# Altium schematic sheet topsheet_Power.SchDoc
size 762 x 508 mm
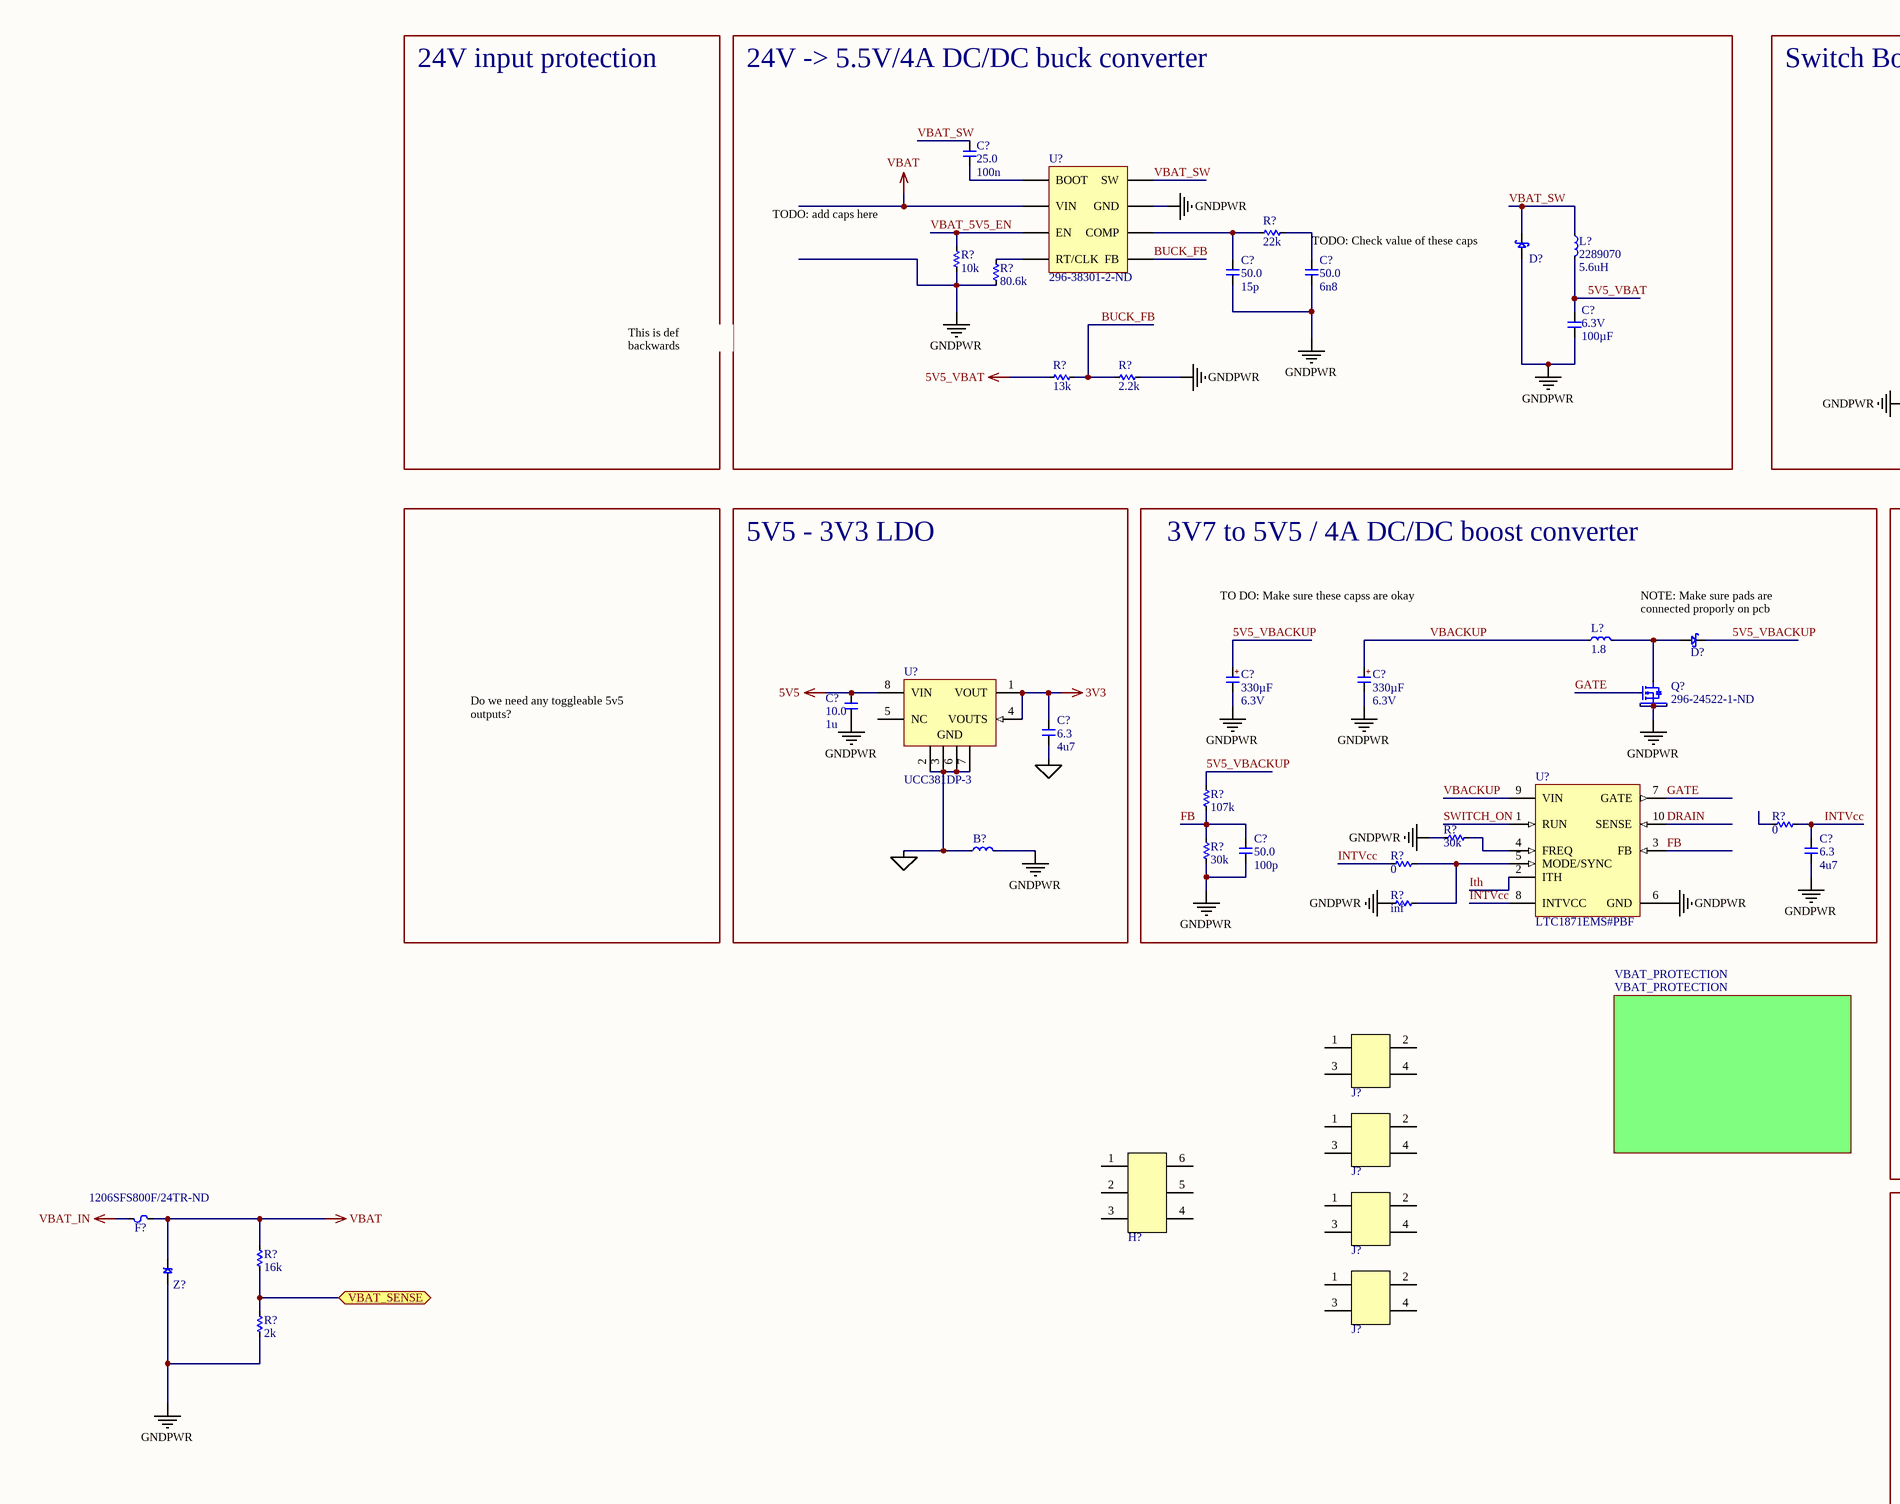
[diagram p0: topsheet_Power.SchDoc, left]
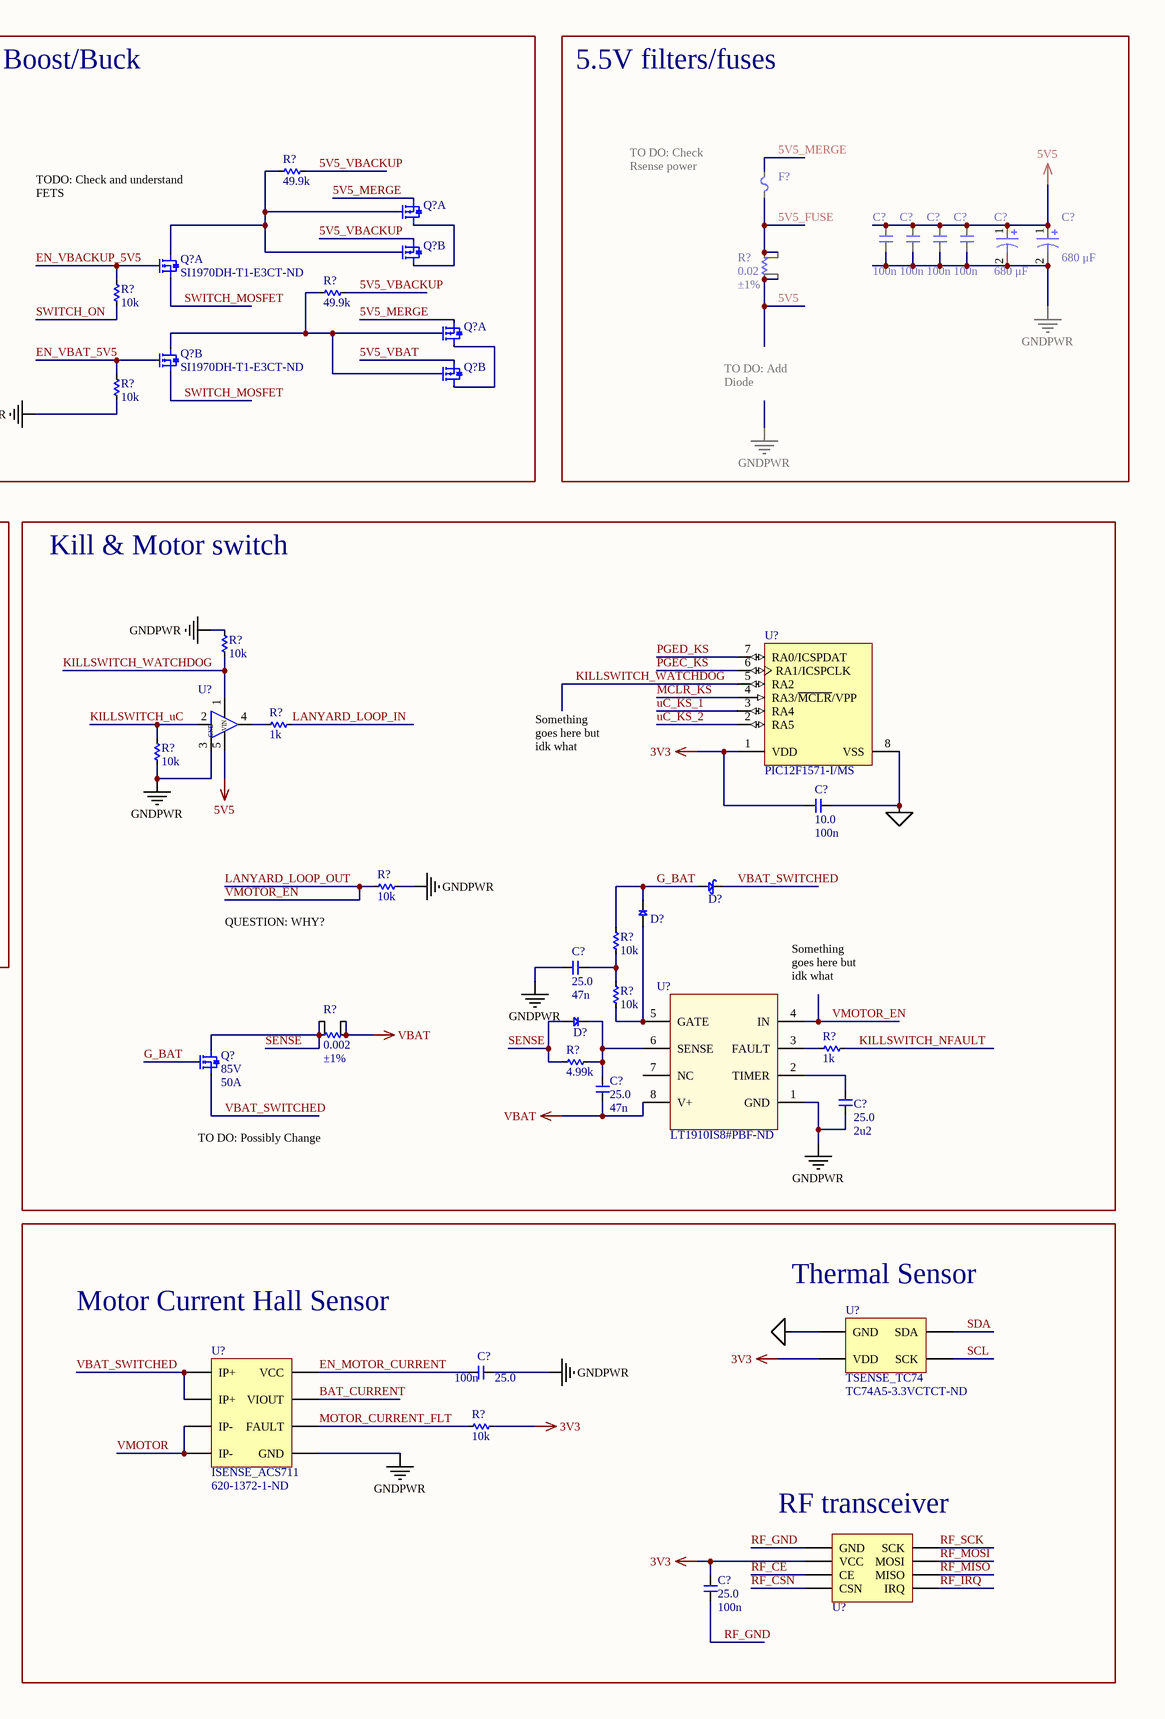
[diagram p1: topsheet_Power.SchDoc, right]

## Parts
(Parts that share a designator on the sheet are numbered #1, #2 ... from top to bottom, then left to right.)
B?  FB_782853112  [R0805]  (value not drawn)
C?#1  voltage: 25.0  human_value: 100n  [C0603]  (hidden comment: __template_cap)
C?#2  human_value: 100n  [C0603]  (hidden comment: __template_cap)
C?#3  human_value: 100n  [C0603]  (hidden comment: __template_cap)
C?#4  human_value: 100n  [C0603]  (hidden comment: __template_cap)
C?#5  human_value: 100n  [C0603]  (hidden comment: __template_cap)
C?#6  680 μF  [WCAP-PTG5 8x8x3.5x0.6]
C?#7  680 μF  [WCAP-PTG5 8x8x3.5x0.6]
C?#8  voltage: 50.0  human_value: 15p  [C0603]  (hidden comment: __template_cap)
C?#9  voltage: 50.0  human_value: 6n8  [C0603]  (hidden comment: __template_cap)
C?#10  Capacitance: 100µF  Voltage - Rated: 6.3V  [C1206]  (hidden comment: __template_cap)
C?#11  Capacitance: 330µF  Voltage - Rated: 6.3V  [C1210P]  (hidden comment: CAP_TANT_330UF_6.3V)
C?#12  Capacitance: 330µF  Voltage - Rated: 6.3V  [C1210P]  (hidden comment: CAP_TANT_330UF_6.3V)
C?#13  voltage: 10.0  human_value: 1u  [C0603]  (hidden comment: __template_cap)
C?#14  voltage: 6.3  human_value: 4u7  [C0603]  (hidden comment: __template_cap)
C?#15  voltage: 10.0  human_value: 100n  [C0603]  (hidden comment: __template_cap)
C?#16  voltage: 50.0  human_value: 100p  [C0603]  (hidden comment: __template_cap)
C?#17  voltage: 6.3  human_value: 4u7  [C0603]  (hidden comment: __template_cap)
C?#18  voltage: 25.0  human_value: 47n  [C0603]  (hidden comment: __template_cap)
C?#19  voltage: 25.0  human_value: 47n  [C0603]  (hidden comment: __template_cap)
C?#20  voltage: 25.0  human_value: 2u2  [C1210]  (hidden comment: __template_cap)
C?#21  voltage: 25.0  human_value: 100n  [C0603]  (hidden comment: __template_cap)
C?#22  voltage: 25.0  human_value: 100n  [C0603]  (hidden comment: __template_cap)
D?#1  __template_diode_schottky  [SMC]  (value not drawn)
D?#2  __template_diode_schottky  [PowerDI5]  (value not drawn)
D?#3  __template_diode_schottky  [DO-220AA]  (value not drawn)
D?#4  __template_diode_std  [SOD523]  (value not drawn)
D?#5  __template_diode_std  [SOD523]  (value not drawn)
F?#1  __template_fuse  (value not drawn)
F?#2  Supplier Part Number 1: 1206SFS800F/24TR-ND  [R1206]  (hidden comment: __template_fuse)
H?  CONN_MOLEX_MICROFIT_43045-0624  [MOLEX_MICROFIT_0430450624]  (value not drawn)
J?#1  CONN HEADER 2x2POS T/H  [CONN_2x2_100MIL_FEMALE_SAMTEC]  (value not drawn)
J?#2  CONN HEADER 2x2POS T/H  [CONN_2x2_100MIL_FEMALE_SAMTEC]  (value not drawn)
J?#3  CONN HEADER 2x2POS T/H  [CONN_2x2_100MIL_FEMALE_SAMTEC]  (value not drawn)
J?#4  CONN HEADER 2x2POS T/H  [CONN_2x2_100MIL_FEMALE_SAMTEC]  (value not drawn)
L?#1  Supplier Part Number 1: 2289070  Inuductance: 5.6uH  [COILCRAFT_XAL5050-103]  (hidden comment: IND_COILCRAFT_XAL5050-562)
L?#2  Inductance: 1.8  [IND_COILCRAFT_XAL60]  (hidden comment: IND_COILCRAFT_XAL6030-182)
Q?#1  PFET_IRF7329PBFCT-ND  [8SOIC150]  (value not drawn)  (part A of 2)
Q?#2  PFET_IRF7329PBFCT-ND  [8SOIC150]  (value not drawn)  (part B of 2)
Q?#3  Supplier Part Number 1: SI1970DH-T1-E3CT-ND  [SOT363-6N]  (hidden comment: NFET_SI1970DH)  (part A of 2)
Q?#4  PFET_IRF7329PBFCT-ND  [8SOIC150]  (value not drawn)  (part A of 2)
Q?#5  Supplier Part Number 1: SI1970DH-T1-E3CT-ND  [SOT363-6N]  (hidden comment: NFET_SI1970DH)  (part B of 2)
Q?#6  PFET_IRF7329PBFCT-ND  [8SOIC150]  (value not drawn)  (part B of 2)
Q?#7  Supplier Part Number 1: 296-24522-1-ND  [8-VSON]  (hidden comment: NFET_CSD16323Q3)
Q?#8  Drain to Source Voltage (Vdss): 85V  Current - Continuous Drain (Id) @ 25° C: 50A  [DPAK]  (hidden comment: 85V 50A TO-252)
R?#1  value 49.9k  [R0603]  (hidden comment: __template_resistor)
R?#2  value 22k  [R0603]  (hidden comment: __template_resistor)
R?#3  value 10k  [R0603]  (hidden comment: __template_resistor)
R?#4  Resistance (Ohms): 0.02  Tolerance: ±1%  [R0805_SHUNT]  (hidden comment: RESISTOR .020 OHM 1/4W 1% 0805)  (net tie)
R?#5  value 80.6k  [R0603]  (hidden comment: __template_resistor)
R?#6  value 49.9k  [R0603]  (hidden comment: __template_resistor)
R?#7  value 10k  [R0603]  (hidden comment: __template_resistor)
R?#8  value 13k  [R0603]  (hidden comment: __template_resistor)
R?#9  value 2.2k  [R0603]  (hidden comment: __template_resistor)
R?#10  value 10k  [R0603]  (hidden comment: __template_resistor)
R?#11  value 10k  [R0603]  (hidden comment: __template_resistor)
R?#12  value 1k  [R0603]  (hidden comment: __template_resistor)
R?#13  value 10k  [R0603]  (hidden comment: __template_resistor)
R?#14  value 107k  [R0603]  (hidden comment: __template_resistor)
R?#15  Resistance: 0  [R0603]  (hidden comment: __template_resistor)
R?#16  value 30k  [R0603]  (hidden comment: __template_resistor)
R?#17  value 30k  [R0603]  (hidden comment: __template_resistor)
R?#18  Resistance: 0  [R0603]  (hidden comment: __template_resistor)
R?#19  value 10k  [R0603]  (hidden comment: __template_resistor)
R?#20  Resistance: inf  [R0603]  (hidden comment: __template_resistor)
R?#21  value 10k  [R0603]  (hidden comment: __template_resistor)
R?#22  value 10k  [R0603]  (hidden comment: __template_resistor)
R?#23  Resistance (Ohms): 0.002  Tolerance: ±1%  [R1206_SHUNT]  (hidden comment: RES_CURRENT_SENSE_0.002_OHM_1W_1%_1206_SMD)  (net tie)
R?#24  value 1k  [R0603]  (hidden comment: __template_resistor)
R?#25  value 4.99k  [R0603]  (hidden comment: __template_resistor)
R?#26  value 16k  [R0603]  (hidden comment: __template_resistor)
R?#27  value 2k  [R0603]  (hidden comment: __template_resistor)
R?#28  value 10k  [R0402]  (hidden comment: __template_resistor)
U?#1  Supplier Part Number 1: 296-38301-2-ND  [8SOIC150E]  (hidden comment: BUCK_TPS54540)
U?#2  PIC12F1571-I/MS  [MCHP-MSOP-MS8_N]
U?#3  UCC381DP-3  [TI-D8_N]
U?#4  BUFFER_SN74AHCT1G125DBVR  [5SOT23]  (value not drawn)
U?#5  LTC1871EMS#PBF  [LT-MS-10_N]
U?#6  Supplier Part Number 1: LT1910IS8#PBF-ND  [8SOIC150]  (hidden comment: FETDRIVER_LT1910)
U?#7  TSENSE_TC74  Supplier Part Number 1: TC74A5-3.3VCTCT-ND  [5SOT23]
U?#8  ISENSE_ACS711  Supplier Part Number 1: 620-1372-1-ND  [8SOIC150]
U?#9  SEEEDSTUDIO_nRF24L01+  [SEEEDSTUDIO_nRF24L01]  (value not drawn)
Z?  __template_diode_zener  [DO-214AA]  (value not drawn)

## Blocks framed on the sheet
24V -> 5.5V/4A DC/DC buck converter: C?#1 C?#8-C?#10 D?#1 L?#1 R?#2 R?#3 R?#5 R?#8 R?#9 U?#1
Switch Boost/Buck: Q?#1-Q?#6 R?#1 R?#6 R?#7 R?#10
5.5V filters/fuses: C?#2-C?#7 F?#1 R?#4
5V5 - 3V3 LDO: B? C?#13 C?#14 U?#3
3V7 to 5V5 / 4A DC/DC boost converter: C?#11 C?#12 C?#16 C?#17 D?#2 L?#2 Q?#7 R?#14-R?#18 R?#20 U?#5
Kill & Motor switch: C?#15 C?#18-C?#20 D?#3-D?#5 Q?#8 R?#11-R?#13 R?#19 R?#21-R?#25 U?#2 U?#4 U?#6

## Sub-sheets
VBAT_PROTECTION = VBAT_PROTECTION: no entries

## Ports
VBAT_SENSE

## Nets
3V3: C?#14.1 C?#15.1 C?#22.1 R?#28.2 U?#2.1(VDD) U?#3.1(VOUT) U?#3.4(VOUTS) U?#7.3(VDD) U?#9.2(VCC)
5V5: C?#2.1 C?#3.1 C?#4.1 C?#5.1 C?#6.1 C?#7.1 C?#13.1 R?#4.1 R?#4.3 U?#3.8(VIN) U?#4.5(VIN)
5V5_VBAT: C?#10.1 L?#1.2 Q?#6.3 R?#8.1
GDNSIG: B?.1 C?#14.2 C?#15.2 U?#2.8(VSS) U?#3.2(GND) U?#3.3(GND) U?#3.6(GND) U?#3.7(GND) U?#7.2(GND)
GNDPWR: B?.2 C?#2.2 C?#3.2 C?#4.2 C?#5.2 C?#6.2 C?#7.2 C?#8.2 C?#9.2 C?#10.2 C?#11.2 C?#12.2 C?#13.2 C?#16.2 C?#17.2 C?#18.2 C?#20.2 C?#21.2 D?#1.1 Q?#7.1(S) Q?#7.2(S) Q?#7.3(S) R?#3.1 R?#5.1 R?#9.2 R?#10.1 R?#11.2 R?#13.1 R?#16.1 R?#17.1 R?#19.1 R?#20.1 R?#27.1 U?#1.7(GND) U?#4.3(GND) U?#5.6(GND) U?#6.1(GND) U?#8.5(GND) Z?.1
VBAT: C?#19.2 F?#2.2 R?#23.1 R?#23.3 R?#26.2 U?#1.2(VIN) U?#6.8(V+) Z?.2
VBAT_IN: F?#2.1
5V5_FUSE: F?#1.2 R?#4.2 R?#4.4
5V5_MERGE: F?#1.1 Q?#1.1 Q?#4.1
5V5_VBACKUP: C?#11.1 D?#2.2 Q?#2.3 R?#1.2 R?#6.2 R?#14.2
BAT_CURRENT: U?#8.7(VIOUT)
BUCK_FB: R?#8.2 R?#9.1 U?#1.5(FB)
DRAIN: U?#5.10(SENSE)
EN_MOTOR_CURRENT: C?#21.1 U?#8.8(VCC)
EN_VBACKUP_5V5: Q?#3.2 R?#7.2
EN_VBAT_5V5: Q?#5.5 R?#10.2
FB: C?#16.1 R?#14.1 R?#17.2 U?#5.3(FB)
G_BAT: D?#3.1 D?#4.2 Q?#8.1 R?#21.2
GATE: Q?#7.4(G) U?#5.7(GATE)
INTVcc: C?#17.1 R?#15.2 R?#18.1 U?#5.8(INTVCC)
Ith: U?#5.2(ITH)
KILLSWITCH_NFAULT: R?#24.2
KILLSWITCH_uC: R?#13.2 U?#4.2
KILLSWITCH_WATCHDOG: R?#11.1 U?#2.5(RA2) U?#4.1
LANYARD_LOOP_IN: R?#12.2
LANYARD_LOOP_OUT: R?#19.2 U?#6.4(IN)  [also labelled VMOTOR_EN]
MCLR_KS: U?#2.4(RA3/~{MCLR}/VPP)
MOTOR_CURRENT_FLT: R?#28.1 U?#8.6(FAULT)
PGEC_KS: U?#2.6(RA1/ICSPCLK)
PGED_KS: U?#2.7(RA0/ICSPDAT)
RF_CE: U?#9.3(CE)
RF_CSN: U?#9.4(CSN)
RF_GND: C?#22.2 U?#9.1(GND)
RF_IRQ: U?#9.8(IRQ)
RF_MISO: U?#9.7(MISO)
RF_MOSI: U?#9.6(MOSI)
RF_SCK: U?#9.5(SCK)
SCL: U?#7.4(SCK)
SDA: U?#7.5(SDA)
SENSE: D?#5.1 Q?#8.2 R?#23.2 R?#23.4 R?#25.1
SWITCH_MOSFET: Q?#3.1 Q?#5.4
SWITCH_ON: R?#7.1 U?#5.1(RUN)
uC_KS_1: U?#2.3(RA4)
uC_KS_2: U?#2.2(RA5)
VBACKUP: C?#12.1 L?#2.1 U?#5.9(VIN)
VBAT_5V5_EN: R?#3.2 U?#1.3(EN)
VBAT_SENSE: R?#26.1 R?#27.2 ; port VBAT_SENSE
VBAT_SW: C?#1.1 D?#1.2 L?#1.1 U?#1.8(SW)
VBAT_SWITCHED: D?#3.2 Q?#8.3 U?#8.1(IP+) U?#8.2(IP+)
VMOTOR: U?#8.3(IP-) U?#8.4(IP-)
NetC?#1_2: C?#1.2 U?#1.1(BOOT)
NetC?#8_1: C?#8.1 R?#2.1 U?#1.6(COMP)
NetC?#9_1: C?#9.1 R?#2.2
NetC?#18_1: C?#18.1 R?#21.1 R?#22.2
NetC?#19_1: C?#19.1 D?#5.2 R?#25.2 U?#6.6(SENSE)
NetC?#20_1: C?#20.1 U?#6.2(TIMER)
NetD?#2_1: D?#2.1 L?#2.2 Q?#7.5(D)
NetD?#4_1: D?#4.1 R?#22.1 U?#6.5(GATE)
NetQ?#1_2: Q?#1.2 Q?#2.4 Q?#3.6 R?#1.1
NetQ?#1_8: Q?#1.8 Q?#2.6
NetQ?#4_2: Q?#4.2 Q?#5.3 Q?#6.4 R?#6.1
NetQ?#4_8: Q?#4.8 Q?#6.6
NetR?#5_2: R?#5.2 U?#1.4(RT/CLK)
NetR?#12_1: R?#12.1 U?#4.4
NetR?#16_2: R?#16.2 U?#5.4(FREQ)
NetR?#18_2: R?#18.2 R?#20.2 U?#5.5(MODE/SYNC)
NetR?#24_1: R?#24.1 U?#6.3(FAULT)

Not connected (* = marked no-connect by the designer): H? 1 2 3 4 5 6; J?#1 1 2 3 4; J?#2 1 2 3 4; J?#3 1 2 3 4; J?#4 1 2 3 4; R?#15 1; U?#3 5(NC); U?#6 7(NC)

## Notes on the sheet
- 24V input protection
- (near F?#1) TO DO: Check Rsense power
- TODO: add caps here
- TODO: Check value of these caps
- TODO: Check and understand FETS
- This is def backwards
- TO DO: Add Diode
- TO DO: Make sure these capss are okay
- NOTE: Make sure pads are connected proporly on pcb
- Do we need any toggleable 5v5 outputs?
- Something goes here but idk what
- (near R?#19) QUESTION: WHY?
- (near U?#6) Something goes here but idk what
- TO DO: Possibly Change Mosfet
- Motor Current Hall Sensor
- (near U?#7) Thermal Sensor
- (near U?#9) RF transceiver
- (in symbol CAP_TANT_330UF_6.3V) +

## Library data of the parts
B? = FB_782853112: FERRITE BEAD 1100 OHM 800MA; Manufacturer: Wurth Electronics Inc; Supplier 1: Digi-Key; RoHS: RoHS Compliant; Category: Filters; Stock 1: 4000; Pricing 1: 1=0.21, 50=0.19, 100=0.175, 500=0.165, 1000=0.159, 2000=0.15 (USD); ComponentLink1URL: http://katalog.we-online.de/pbs/datasheet/782853112.pdf; ComponentLink1Description: http://katalog.we-online.de/pbs/datasheet/782853112.pdf; Supplier Part Number 1: 732-6713-1-ND; Manufacturer Part Number: 782853112
C?#1 = 399-1281-1-ND: type: capacitor; value: 1e-07; tolerance: 10%; Supplier Part Number 1: 399-1281-1-ND; package: 0603; price: 0.075
C?#2-C?#5 = 399-1095-1-ND: voltage: 10.0; type: capacitor; value: 1e-07; tolerance: 10%; Supplier Part Number 1: 399-1095-1-ND; package: 0603; price: 0.053
C?#6 C?#7 = WCAP-PTG5 8x8x3.5x0.6 870025174008: WCAP-PTG5 Aluminum Polymer Capacitors , 680 μF; + / - 20%; 6,3 V , 8 x 8; Manufacturer: Wurth Elektronik; E-mail: libraries@we-online.com; Characteristics: Aluminum Polymer Capacitors; Recommended soldering: Wave ;Operating temperature: –55 °C to +105 °C ; Low ESR at high frequency range; High permissible ripple current; Long life: 2000 h @ +105 °C; ComponentLink1Description: Manufacturer; ComponentLink1URL: http://www.we-online.com; ComponentLink2Description: Datasheet; ComponentLink2URL: http://katalog.we-online.de/pbs/datasheet/870025174008.pdf; Created by: Karrer Zheng; Created Date: 5/13/2015; Capacitance: 680 μF; Application: Low voltage port filtering, appplid to high-end switching power supply, PC(desktop,laptop ),industrial computer, VGA card, server power, charger, TV, digital set-top box,DC-DC power module, game machine etc which consume large current with high speed circuit.; partNo: 870025174008
C?#8 = 478-1165-1-ND: type: capacitor; value: 1.5e-11; tolerance: 5%; Supplier Part Number 1: 478-1165-1-ND; package: 0603; price: 0.16
C?#9 = 399-1090-1-ND: type: capacitor; value: 6.8e-09; tolerance: 5%; Supplier Part Number 1: 399-1090-1-ND; package: 0603; price: 0.429
C?#10 = __template_cap: Manufacturer: Murata Electronics North America; Manufacturer Part Number: GRM31CR60J107ME39K; Tolerance: ±20%; Temperature Coefficient: X5R; Supplier 1: Digi-Key; Supplier Part Number 1: 490-7217-1-ND; RoHS: RoHS Compliant; Category: Capacitors; Stock 1: 49063; Pricing 1: 1=0.6, 10=0.57, 50=0.34, 100=0.2763, 250=0.22952, 500=0.20826, 1000=0.19125 (USD); Packaging: Cut Tape (CT); Mounting Type: Surface Mount, MLCC; Operating Temperature: -55°C ~ 85°C; Applications: General Purpose; Ratings: -; Package / Case: 1206 (3216 Metric); Size / Dimension: 0.126" L x 0.063" W (3.20mm x 1.60mm); Height - Seated (Max): -; Thickness (Max): 0.071" (1.80mm); Lead Spacing: -; Features: -; Lead Style: -; ComponentLink1URL: http://www.murata.com/~/media/webrenewal/support/library/catalog/products/capacitor/mlcc/c02e.pdf; ComponentLink1Description: http://www.murata.com/~/media/webrenewal/support/library/catalog/products/capacitor/mlcc/c02e.pdf
C?#11 C?#12 = CAP_TANT_330UF_6.3V: 330UF 1210 SMD TANTALUM CAPACITOR; Manufacturer: AVX Corporation; Manufacturer Part Number: F950J337KBAAQ2; Manufacturer Size Code: B; Tolerance: ±10%; ESR (Equivalent Series Resistance): 600 mOhm; Type: Conformal Coated; Supplier 1: Digi-Key; RoHS: RoHS Compliant; Category: Capacitors; Stock 1: 12610; Pricing 1: 1=2.24, 10=1.857, 100=1.5567, 250=1.28356, 500=1.14702, 1000=1.03778 (USD); Packaging: Cut Tape (CT); Operating Temperature: -55°C ~ 125°C; Mounting Type: Surface Mount; Package / Case: 1210 (3528 Metric); Size / Dimension: 0.138" L x 0.110" W (3.50mm x 2.80mm); Height - Seated (Max): 0.079" (2.00mm); Lead Spacing: -; Features: General Purpose; Lifetime @ Temp.: -; ComponentLink1URL: http://datasheets.avx.com/f95.pdf; ComponentLink1Description: http://datasheets.avx.com/f95.pdf; Supplier Part Number 1: 478-8407-1-ND
C?#13 = 478-1251-1-ND: type: capacitor; value: 1e-06; tolerance: 10%; Supplier Part Number 1: 478-1251-1-ND; package: 0603; price: 0.138
C?#14 = 399-3482-1-ND: type: capacitor; value: 4.7e-06; tolerance: 10%; Supplier Part Number 1: 399-3482-1-ND; package: 0603; price: 0.18
C?#15 = 399-1095-1-ND: type: capacitor; value: 1e-07; tolerance: 10%; Supplier Part Number 1: 399-1095-1-ND; package: 0603; price: 0.053
C?#16 = 478-1175-1-ND: type: capacitor; value: 1e-10; tolerance: 5%; Supplier Part Number 1: 478-1175-1-ND; package: 0603; price: 0.05
C?#17 = 587-1255-1-ND: type: capacitor; value: 4.7e-06; tolerance: 20%; Supplier Part Number 1: 587-1255-1-ND; package: 0603; price: 0.18
C?#18 C?#19 = 478-1235-1-ND: type: capacitor; value: 4.7e-08; tolerance: 10%; Supplier Part Number 1: 478-1235-1-ND; package: 0603; price: 0.12
C?#20 = 399-3084-1-ND: type: capacitor; value: 2.2e-06; tolerance: 10%; Supplier Part Number 1: 399-3084-1-ND; package: 1210; price: 0.536
C?#21 C?#22 = 399-1282-1-ND: type: capacitor; value: 1e-07; tolerance: 5%; Supplier Part Number 1: 399-1282-1-ND; package: 0603; price: 0.349
D?#1 = __template_diode_schottky: Manufacturer: Vishay Semiconductor Diodes Division; Manufacturer Part Number: SSC54-E3/57T; Voltage - DC Reverse (Vr) (Max): 40V; Current - Average Rectified (Io): 5A; Voltage - Forward (Vf) (Max) @ If: 490mV @ 5A; Speed: Fast Recovery =< 500ns, > 200mA (Io); Current - Reverse Leakage @ Vr: 500µA @ 40V; Supplier 1: Digi-Key; Supplier Part Number 1: SSC54-E3/57TGICT-ND; RoHS: RoHS Compliant; Category: Discrete Semiconductor Products; Stock 1: 16997; Pricing 1: 1=0.59, 10=0.52, 25=0.4884, 100=0.3984, 250=0.37012 (USD); Packaging: Cut Tape (CT); Diode Type: Schottky; Reverse Recovery Time (trr): -; Capacitance @ Vr, F: -; Mounting Type: Surface Mount; Package / Case: DO-214AB, SMC; Supplier Device Package: DO-214AB, (SMC); Operating Temperature - Junction: -65°C ~ 150°C; ComponentLink1URL: http://www.vishay.com/docs/88885/ssc53l.pdf; ComponentLink1Description: http://www.vishay.com/docs/88885/ssc53l.pdf
D?#3 = __template_diode_schottky: Manufacturer: Vishay Semiconductor Diodes Division; Manufacturer Part Number: SMP12A-M3/84A; Type: Zener; Unidirectional Channels: 1; Voltage - Reverse Standoff (Typ): 12V; Voltage - Breakdown (Min): 13.3V; Voltage - Clamping (Max) @ Ipp: 19.9V; Current - Peak Pulse (10/1000µs): 20.1A; Power - Peak Pulse: 400W; Power Line Protection: No; Supplier 1: Digi-Key; Supplier Part Number 1: SMP12A-M3/84ACT-ND; RoHS: RoHS Compliant; Category: Circuit Protection; Stock 1: 5653; Pricing 1: 1=0.42, 10=0.314, 25=0.2832, 100=0.1957, 250=0.1648, 500=0.1339, 1000=0.103 (USD); Packaging: Cut Tape (CT); Bidirectional Channels: -; Applications: General Purpose; Capacitance @ Frequency: -; Operating Temperature: -55°C ~ 150°C (TJ); Mounting Type: Surface Mount; Package / Case: DO-220AA; Supplier Device Package: DO-220AA (SMP); ComponentLink1URL: http://www.vishay.com/docs/88481/smp3v3.pdf; ComponentLink1Description: http://www.vishay.com/docs/88481/smp3v3.pdf
D?#4 D?#5 = __template_diode_std: Manufacturer: Panasonic Electronic Components; Manufacturer Part Number: DA2S10100L; Diode Type: Standard; Voltage - DC Reverse (Vr) (Max): 80V; Current - Average Rectified (Io): 100mA (DC); Voltage - Forward (Vf) (Max) @ If: 1.2V @ 100mA; Speed: Small Signal =< 200mA (Io), Any Speed; Reverse Recovery Time (trr): 3ns; Current - Reverse Leakage @ Vr: 100nA @ 75V; Capacitance @ Vr, F: 1.2pF @ 0V, 1MHz; Supplier 1: Digi-Key; Supplier Part Number 1: DA2S10100LCT-ND; RoHS: RoHS Compliant; Category: Discrete Semiconductor Products; Stock 1: 95803; Pricing 1: 1=0.1, 10=0.04, 25=0.0324, 100=0.0252, 250=0.02448, 500=0.02378, 1000=0.02162 (USD); Packaging: Cut Tape (CT); Mounting Type: Surface Mount; Package / Case: SC-79, SOD-523; Supplier Device Package: SSMini2-F5-B; Operating Temperature - Junction: 150°C (Max); ComponentLink1URL: http://industrial.panasonic.com/www-cgi/jvcr13pz.cgi?E+SC+4+ANA7001+DA2S101+8+WW; ComponentLink1Description: http://industrial.panasonic.com/www-cgi/jvcr13pz.cgi?E+SC+4+ANA7001+DA2S101+8+WW
F?#2 = __template_fuse: Manufacturer: Littelfuse Inc.; Manufacturer Part Number: 1206SFS800F/24-2; Fuse Type: Board Mount (Cartridge Style Excluded); Current Rating: 8A; Voltage Rating - DC: 24V; Response Time: Slow; Breaking Capacity @ Rated Voltage: 60A; Melting I²t: 16.9; Approvals: UL; DC Cold Resistance: 0.009 Ohm; Supplier 1: Digi-Key; RoHS: RoHS Compliant; Category: Circuit Protection; Stock 1: 6000; Pricing 1: 3000=0.31625, 6000=0.3105, 15000=0.299 (USD); Packaging: Tape & Reel (TR); Voltage Rating - AC: -; Package / Case: 1206 (3216 Metric); Mounting Type: Surface Mount; Operating Temperature: -55°C ~ 125°C; Color: -; Size / Dimension: 0.126" L x 0.063" W x 0.038" H (3.20mm x 1.60mm x 0.97mm); ComponentLink1URL: http://www.te.com/commerce/DocumentDelivery/DDEController?Action=srchrtrv&DocNm=CLP00009&DocType=CS&DocLang=English; ComponentLink1Description: http://www.te.com/commerce/DocumentDelivery/DDEController?Action=srchrtrv&DocNm=CLP00009&DocType=CS&DocLang=English
H? = CONN_MOLEX_MICROFIT_43045-0624: MOLEX MICROFIT 2 ROW 6PIN VERT ThroughHole; Manufacturer: Molex Inc; Manufacturer Part Number: 0430450624; Connector Type: Header, Shrouded; Number of Positions: 6; Number of Positions Loaded: All; Pitch: 0.118" (3.00mm); Supplier 1: Digi-Key; RoHS: RoHS Compliant; Category: Connectors, Interconnects; Stock 1: 1294; Pricing 1: 1=1.75, 10=1.45, 50=1.2082, 100=1.074, 250=0.93976, 500=0.8592, 1000=0.77865, 2500=0.6981, 5000=0.68468 (USD); Contact Type: Male Pin; Number of Rows: 2; Row Spacing: 0.118" (3.00mm); Contact Mating Length: -; Mounting Type: Through Hole; Termination: Kinked Pin; Fastening Type: Latch Lock; Features: Board Lock; Contact Finish: Tin; Contact Finish Thickness: 100µin (2.54µm); Color: Black; Packaging: Tray; ComponentLink1URL: http://www.molex.com/elqNow/elqRedir.htm?ref=http://www.molex.com/pdm_docs/sd/430450624_sd.pdf; ComponentLink1Description: http://www.molex.com/elqNow/elqRedir.htm?ref=http://www.molex.com/pdm_docs/sd/430450624_sd.pdf; Supplier Part Number 1: WM4039-ND
J?#1-J?#4 = CONN_2x2
L?#1 = IND_COILCRAFT_XAL5050-562: INDUCTOR 5.6UH 20% SMD; Manufacturer Part Number: XAL5050-562MEB; Supplier 1: Farnell; Manufacturer: COILCRAFT; RoHS: YES; Stock 1: 158; Pricing 1: 1=3.16, 2=2.73, 3=2.52, 5=2.31, 10=1.88 (GBP); ComponentLink1URL: http://www.farnell.com/datasheets/1681990.pdf; ComponentLink1Description: http://www.farnell.com/datasheets/1681990.pdf
L?#2 = IND_COILCRAFT_XAL6030-182: Fixed Inductors XAL6030 High Current 1.8 uH 20 % 14 A; Manufacturer Part Number: XAL6030-182MEC; Product Range: AEC-Q200 XAL6030 Series; Inductance Tolerance: ± 20%; Inductor Construction: Shielded; DC Resistance Max: 0.01052; RMS Current (Irms): 14; Saturation Current (Isat): 18.2; Power Inductor Case: 6.56mm x 6.36mm x 3.1; SVHC: No SVHC (15-Jun-2015); Self Resonant Frequency Min: 34; Supplier 1: Farnell; Manufacturer: COILCRAFT; RoHS: YES; Pricing 1: 1=2.08, 15=1.4, 40=1.34, 90=1.16, 200=0.949 (GBP); Packaging: Cut Tape; ComponentLink1URL: http://www.farnell.com/datasheets/1681993.pdf; ComponentLink1Description: http://www.farnell.com/datasheets/1681993.pdf; Supplier Part Number 1: 2289082
Q?#1 Q?#2 Q?#4 Q?#6 = PFET_IRF7329PBFCT-ND: MOSFET 2P-CH 12V 9.2A 8-SOIC; Manufacturer: Infineon Technologies; Manufacturer Part Number: IRF7329TRPBF; FET Type: 2 P-Channel (Dual); FET Feature: Logic Level Gate; Rds On (Max) @ Id, Vgs: 17 mOhm @ 9.2A, 4.5V; Vgs(th) (Max) @ Id: 900mV @ 250µA; Gate Charge (Qg) @ Vgs: 57nC @ 4.5V; Input Capacitance (Ciss) @ Vds: 3450pF @ 10V; Power - Max: 2W; Supplier 1: Digi-Key; RoHS: RoHS Compliant; Category: Discrete Semiconductor Products; Stock 1: 8920; Pricing 1: 1=1.18, 10=1.054, 100=0.822, 500=0.67908, 1000=0.53612 (USD); Packaging: Cut Tape (CT); Drain to Source Voltage (Vdss): 12V; Current - Continuous Drain (Id) @ 25°C: 9.2A; Operating Temperature: -55°C ~ 150°C (TJ); Mounting Type: Surface Mount; Package / Case: 8-SOIC (0.154", 3.90mm Width); Supplier Device Package: 8-SO; ComponentLink1URL: http://www.irf.com/product-info/datasheets/data/irf7329pbf.pdf; ComponentLink1Description: http://www.irf.com/product-info/datasheets/data/irf7329pbf.pdf; Supplier Part Number 1: IRF7329PBFCT-ND
Q?#3 Q?#5 = NFET_SI1970DH: MOSFET 2N-CH 30V 1.3A SC70-6; Manufacturer: Vishay Siliconix; Manufacturer Part Number: SI1970DH-T1-E3; FET Type: 2 N-Channel (Dual); FET Feature: Logic Level Gate; Rds On (Max) @ Id, Vgs: 225 mOhm @ 1.2A, 4.5V; Vgs(th) (Max) @ Id: 1.6V @ 250µA; Gate Charge (Qg) @ Vgs: 3.8nC @ 10V; Input Capacitance (Ciss) @ Vds: 95pF @ 15V; Power - Max: 1.25W; Supplier 1: Digi-Key; RoHS: RoHS Compliant; Category: Discrete Semiconductor Products; Stock 1: 0; Pricing 1: 1=0 (USD); Packaging: Cut Tape (CT); Drain to Source Voltage (Vdss): 30V; Current - Continuous Drain (Id) @ 25°C: 1.3A; Operating Temperature: -55°C ~ 150°C (TJ); Mounting Type: Surface Mount; Package / Case: 6-TSSOP, SC-88, SOT-363; Supplier Device Package: SC-70-6 (SOT-363); ComponentLink1URL: http://www.vishay.com/docs/74343/SI1970DH.pdf; ComponentLink1Description: http://www.vishay.com/docs/74343/SI1970DH.pdf
Q?#7 = NFET_CSD16323Q3: MOSFET N-CH 25V 3.3X3.3 8-SON; Manufacturer: Texas Instruments; FET Type: MOSFET N-Channel, Metal Oxide; FET Feature: Logic Level Gate; Current - Continuous Drain (Id) @ 25°C: 21A (Ta), 60A (Tc); Rds On (Max) @ Id, Vgs: 4.5 mOhm @ 24A, 8V; Vgs(th) (Max) @ Id: 1.4V @ 250µA; Gate Charge (Qg) @ Vgs: 8.4nC @ 4.5V; Input Capacitance (Ciss) @ Vds: 1300pF @ 12.5V; Power - Max: 3W; Supplier 1: Digi-Key; Manufacturer Part Number: CSD16323Q3; RoHS: RoHS Compliant By Exemption; Category: Discrete Semiconductor Products; Stock 1: 23688; Pricing 1: 1=1.19, 10=1.061, 100=0.8271, 500=0.68404, 1000=0.43625 (USD); Packaging: Cut Tape (CT); Drain to Source Voltage (Vdss): 25V; Operating Temperature: -55°C ~ 150°C (TJ); Mounting Type: Surface Mount; Package / Case: 8-PowerTDFN; Supplier Device Package: 8-VSON (3.3x3.3); ComponentLink1URL: http://www.ti.com/lit/ds/symlink/csd16323q3.pdf; ComponentLink1Description: http://www.ti.com/lit/ds/symlink/csd16323q3.pdf
Q?#8 = NFET_IXTY50N085T: MOSFET N-CH 85V 50A TO-252; Manufacturer: IXYS; FET Type: MOSFET N-Channel, Metal Oxide; FET Feature: Standard; Rds On (Max) @ Id, Vgs: 23 mOhm @ 500mA, 10V; Vgs(th) (Max) @ Id: 4V @ 25µA; Gate Charge (Qg) @ Vgs: 34nC @ 10V; Input Capacitance (Ciss) @ Vds: 1460pF @ 25V; Power - Max: 130W; Supplier 1: Digi-Key; Manufacturer Part Number: IXTY50N085T; RoHS: RoHS Compliant; Category: Discrete Semiconductor Products; Stock 1: 1273; Pricing 1: 1=1.44, 25=1.148, 100=1.0045, 250=0.88152, 500=0.779, 1000=0.615, 2500=0.574 (USD); Mounting Type: Surface Mount; Package / Case: TO-252-3, DPak (2 Leads + Tab), SC-63; Supplier Device Package: TO-252, (D-Pak); Packaging: Tube; ComponentLink1URL: http://ixdev.ixys.com/DataSheet/460f7899-e172-4f13-9863-adac246f799b.pdf; ComponentLink1Description: http://ixdev.ixys.com/DataSheet/460f7899-e172-4f13-9863-adac246f799b.pdf; Supplier Part Number 1: IXTY50N085T-ND
R?#1 R?#6 = CRCW060349K9FKEA: RES SMD 49.9K OHM 1% 1/10W 0603; Manufacturer: Vishay Dale; Resistance (Machine readable): 49900; Unit Price (USD): 0.081; Power (Watts): 0.1W, 1/10W; Supplier Part Number: 541-49.9KHCT-ND; Manufacturer Part Number: CRCW060349K9FKEA; type: resistor; Packaging: Cut Tape (CT); Series: CRCW; Tolerance: ±1%; Package: 0603 (1608 Metric)
R?#2 = CRCW060322K0FKEA: RES SMD 22K OHM 1% 1/10W 0603; Manufacturer: Vishay Dale; Resistance (Machine readable): 22000; Unit Price (USD): 0.081; Power (Watts): 0.1W, 1/10W; Supplier Part Number: 541-22.0KHCT-ND; Manufacturer Part Number: CRCW060322K0FKEA; type: resistor; Packaging: Cut Tape (CT); Series: CRCW; Tolerance: ±1%; Package: 0603 (1608 Metric)
R?#3 R?#7 R?#10 R?#11 R?#13 R?#19 R?#21 R?#22 = CRCW060310K0FKEA: RES SMD 10K OHM 1% 1/10W 0603; Manufacturer: Vishay Dale; Resistance (Machine readable): 10000; Unit Price (USD): 0.081; Power (Watts): 0.1W, 1/10W; Supplier Part Number: 541-10.0KHCT-ND; Manufacturer Part Number: CRCW060310K0FKEA; type: resistor; Packaging: Cut Tape (CT); Series: CRCW; Tolerance: ±1%; Package: 0603 (1608 Metric)
R?#4 = RES_CURRENT_SENSE_0.020_OHM_0.25W_1%: Manufacturer: Panasonic - ECG; Manufacturer Part Number: ERJ-6BWFR020V; Power (Watts): 0.25W, 1/4W; Temperature Coefficient: ±200ppm/°C; Supplier 1: Digi-Key; RoHS: RoHS Compliant; Category: Resistors; Stock 1: 29378; Pricing 1: 1=0.77, 50=0.569, 100=0.5229, 250=0.4614, 500=0.3845, 1000=0.29991 (USD); Composition: Thick Film; Features: Current Sense; Size / Dimension: 0.079" L x 0.049" W (2.00mm x 1.25mm); Height: 0.030" (0.75mm); Number of Terminations: 2; Packaging: Cut Tape (CT); Package / Case: 0805 (2012 Metric); ComponentLink1URL: http://industrial.panasonic.com/www-data/pdf/AOA0000/AOA0000CE3.pdf; ComponentLink1Description: Datasheet; Supplier Part Number 1: P.02AQCT-ND
R?#5 = CRCW060380K6FKEA: RES SMD 80.6K OHM 1% 1/10W 0603; Manufacturer: Vishay Dale; Resistance (Machine readable): 80600; Unit Price (USD): 0.081; Power (Watts): 0.1W, 1/10W; Supplier Part Number: 541-80.6KHCT-ND; Manufacturer Part Number: CRCW060380K6FKEA; type: resistor; Packaging: Cut Tape (CT); Series: CRCW; Tolerance: ±1%; Package: 0603 (1608 Metric)
R?#8 = CRCW060313K0FKEA: RES SMD 13K OHM 1% 1/10W 0603; Manufacturer: Vishay Dale; Resistance (Machine readable): 13000; Unit Price (USD): 0.081; Power (Watts): 0.1W, 1/10W; Supplier Part Number: 541-13.0KHCT-ND; Manufacturer Part Number: CRCW060313K0FKEA; type: resistor; Packaging: Cut Tape (CT); Series: CRCW; Tolerance: ±1%; Package: 0603 (1608 Metric)
R?#9 = CRCW06032K20FKEA: RES SMD 2.2K OHM 1% 1/10W 0603; Manufacturer: Vishay Dale; Resistance (Machine readable): 2200; Unit Price (USD): 0.081; Power (Watts): 0.1W, 1/10W; Supplier Part Number: 541-2.20KHCT-ND; Manufacturer Part Number: CRCW06032K20FKEA; type: resistor; Packaging: Cut Tape (CT); Series: CRCW; Tolerance: ±1%; Package: 0603 (1608 Metric)
R?#12 R?#24 = CRCW06031K00FKEA: RES SMD 1K OHM 1% 1/10W 0603; Manufacturer: Vishay Dale; Resistance (Machine readable): 1000; Unit Price (USD): 0.081; Power (Watts): 0.1W, 1/10W; Supplier Part Number: 541-1.00KHCT-ND; Manufacturer Part Number: CRCW06031K00FKEA; type: resistor; Packaging: Cut Tape (CT); Series: CRCW; Tolerance: ±1%; Package: 0603 (1608 Metric)
R?#14 = CRCW0603107KFKEA: RES SMD 107K OHM 1% 1/10W 0603; Manufacturer: Vishay Dale; Resistance (Machine readable): 107000; Unit Price (USD): 0.081; Power (Watts): 0.1W, 1/10W; Supplier Part Number: 541-107KHCT-ND; Manufacturer Part Number: CRCW0603107KFKEA; type: resistor; Packaging: Cut Tape (CT); Series: CRCW; Tolerance: ±1%; Package: 0603 (1608 Metric)
R?#16 R?#17 = CRCW060330K0FKEA: RES SMD 30K OHM 1% 1/10W 0603; Manufacturer: Vishay Dale; Resistance (Machine readable): 30000; Unit Price (USD): 0.081; Power (Watts): 0.1W, 1/10W; Supplier Part Number: 541-30.0KHCT-ND; Manufacturer Part Number: CRCW060330K0FKEA; type: resistor; Packaging: Cut Tape (CT); Series: CRCW; Tolerance: ±1%; Package: 0603 (1608 Metric)
R?#23 = RES_CURRENT_SENSE_0.002_OHM_1W_1%_1206_SMD: RES .002OHM 1W 1% 1206 SMD; Manufacturer: Stackpole Electronics Inc; Manufacturer Part Number: CSNL1206FT2L00; Temperature Coefficient: ±50ppm/°C; Supplier 1: Digi-Key; RoHS: RoHS Compliant; Category: Resistors; Stock 1: 16743; Pricing 1: 1=1.05, 10=0.742, 50=0.56, 100=0.49, 250=0.434, 500=0.364, 1000=0.28 (USD); Power (Watts): 1W; Composition: Metal Foil; Features: Current Sense; Package / Case: 1206 (3216 Metric); Size / Dimension: 0.130" L x 0.071" W (3.30mm x 1.80mm); Height: 0.039" (1.00mm); Number of Terminations: 2; Packaging: Cut Tape (CT); ComponentLink1URL: http://www.seielect.com/catalog/SEI-CSNL.pdf; ComponentLink1Description: Datasheet; Supplier Part Number 1: CSNL1206FT2L00CT-ND
R?#25 = CRCW06034K99FKEA: RES SMD 4.99K OHM 1% 1/10W 0603; Manufacturer: Vishay Dale; Resistance (Machine readable): 4990; Unit Price (USD): 0.081; Power (Watts): 0.1W, 1/10W; Supplier Part Number: 541-4.99KHCT-ND; Manufacturer Part Number: CRCW06034K99FKEA; type: resistor; Packaging: Cut Tape (CT); Series: CRCW; Tolerance: ±1%; Package: 0603 (1608 Metric)
R?#26 = CRCW060316K0FKEA: RES SMD 16K OHM 1% 1/10W 0603; Manufacturer: Vishay Dale; Resistance (Machine readable): 16000; Unit Price (USD): 0.081; Power (Watts): 0.1W, 1/10W; Supplier Part Number: 541-16.0KHCT-ND; Manufacturer Part Number: CRCW060316K0FKEA; type: resistor; Packaging: Cut Tape (CT); Series: CRCW; Tolerance: ±1%; Package: 0603 (1608 Metric)
R?#27 = CRCW06032K00FKEA: RES SMD 2K OHM 1% 1/10W 0603; Manufacturer: Vishay Dale; Resistance (Machine readable): 2000; Unit Price (USD): 0.081; Power (Watts): 0.1W, 1/10W; Supplier Part Number: 541-2.00KHCT-ND; Manufacturer Part Number: CRCW06032K00FKEA; type: resistor; Packaging: Cut Tape (CT); Series: CRCW; Tolerance: ±1%; Package: 0603 (1608 Metric)
R?#28 = CRCW040210K0FKED: RES SMD 10K OHM 1% 1/16W 0402; Manufacturer: Vishay Dale; Resistance (Machine readable): 10000; Unit Price (USD): 0.083; Power (Watts): 0.063W, 1/16W; Supplier Part Number: 541-10.0KLCT-ND; Manufacturer Part Number: CRCW040210K0FKED; type: resistor; Packaging: Cut Tape (CT); Series: CRCW; Tolerance: ±1%; Package: 0402 (1005 Metric)
U?#1 = BUCK_TPS54540: Split Rail Switching Regulator IC Positive Adjustable 0.8V 1 Output 5A 8-SOIC (0.154", 3.90mm Width) Exposed Pad; Manufacturer: Texas Instruments; Manufacturer Part Number: TPS54540QDDARQ1; Function: Step-Down; Topology: Buck, Split Rail; Number of Outputs: 1; Voltage - Input (Min): 4.5V; Voltage - Input (Max): 42V; Voltage - Output (Max): 41.1V; Frequency - Switching: 100kHz ~ 2.5MHz; Synchronous Rectifier: No; Supplier 1: Digi-Key; RoHS: RoHS Compliant; Category: Integrated Circuits (ICs); Stock 1: 0; Pricing 1: 2500=2.61125 (USD); Packaging: Tape & Reel (TR); Output Configuration: Positive; Output Type: Adjustable; Voltage - Output (Min/Fixed): 0.8V; Current - Output: 5A; Operating Temperature: -40°C ~ 150°C (TJ); Mounting Type: Surface Mount; Package / Case: 8-SOIC (0.154", 3.90mm Width) Exposed Pad; Supplier Device Package: 8-SO PowerPad; ComponentLink1URL: http://www.ti.com/lit/ds/symlink/tps54540-q1.pdf; ComponentLink1Description: http://www.ti.com/lit/ds/symlink/tps54540-q1.pdf
U?#2 = PIC12F1571-I/MS: Microcontroller with High Precision 16-Bit PWMs, 1K (x14-Bit words) Program Memory, 128 Bytes SRAM, 6 I/O, Industrial Temperature, 8-Pin MSOP (MS8), Tube; Manufacturer: Microchip; VCC Range: 2.3 to 5.5 V; DatasheetVersion: Rev. A; PackageVersion: C04-111C, 12/2012; PackageReference: MSOP-MS8; PackageDescription: 8-Lead Plastic Micro Small Outline Package, 3 x 3 mm Body, 0.65 mm Pitch; Supplier 1: Digi-Key; Supplier Part Number 1: PIC12F1571-I/MS-ND; Supplier 2: Newark; Supplier Part Number 2: 17X9200; Supplier 3: Mouser; Supplier Part Number 3: 579-PIC12F1571-I/MS; Packing: Tube; Mounting Technology: Surface Mount; PartNumber: PIC12F1571-I/MS; ComponentLink1Description: Manufacturer URL; ComponentLink1URL: http://www.microchip.com/; ComponentLink2Description: Datasheet; ComponentLink2URL: http://ww1.microchip.com/downloads/en/DeviceDoc/40001723A.pdf; ComponentLink3Description: Package Specification; ComponentLink3URL: http://www.microchip.com/stellent/groups/techpub_sg/documents/packagingspec/en012702.pdf
U?#3 = UCC381DP-3: Single Output LDO, 1 A, Fixed 3.3 V Output, 3.9 to 9 V Input, with Low IQ, 8-pin SOIC (D), 0 to 70 degC, Green (RoHS & no Sb/Br); Manufacturer: Texas Instruments; Accuracy(%): 2.5; Fixed Output Options(V): 3.3; Iout(Max)(A): 1; Iq(Typ)(mA): 0.4; Rating: Catalog; SubFamily: Single Channel LDO; Vdo(Typ)(mV): 500; Vin(Max)(V): 9; Vin(Min)(V): 3.9; DatasheetVersion: SLUS214B; PackageVersion: 4040047-3/M; PackageReference: D8; PackageDescription: 8-Pin Plastic Small Outline, Body 4.9 x 3.9 mm, Pitch 1.27 mm; Supplier 1: Digi-Key; Supplier Part Number 1: 296-2819-5-ND; Supplier 2: Newark; Supplier Part Number 2: 77C2438; Supplier 3: Mouser; Supplier Part Number 3: 595-UCC381DP-3; Eco-Plan: Green (RoHS & no Sb/Br); Vout Adj(Max)(V): 3.3; Vout Adj(Min)(V): 3.3; Mounting Technology: Surface Mount; Code_JEDEC: MS-012; PartNumber: UCC381DP-3; ComponentLink1Description: Manufacturer URL; ComponentLink1URL: http://www.ti.com/; ComponentLink2Description: Datasheet; ComponentLink2URL: http://www.ti.com/general/docs/lit/getliterature.tsp?genericPartNumber=UCC381-3&fileType=pdf; ComponentLink3Description: Package Specification; ComponentLink3URL: http://www.ti.com/litv/pdf/msoi002j; ComponentLink4Description: URL Link1; ComponentLink4URL: Samples URL:http://www.ti.com/product/ucc381-3#samples
U?#4 = BUFFER_SN74AHCT1G125DBVR: IC BUS BUFF TRI-ST N-INV SOT23-5; Manufacturer: Texas Instruments; Logic Type: Buffer, Non-Inverting; Number of Elements: 1; Output Type: Push-Pull; Current - Output High, Low: 8mA, 8mA; Voltage - Supply: 4.5 V ~ 5.5 V; Supplier 1: Digi-Key; Manufacturer Part Number: SN74AHCT1G125DBVR; RoHS: RoHS Compliant; Category: Integrated Circuits (ICs); Stock 1: 63311; Pricing 1: 1=0.42, 10=0.315, 100=0.196, 500=0.134, 1000=0.103 (USD); Packaging: Cut Tape (CT); Number of Bits per Element: 1; Input Type: -; Operating Temperature: -40°C ~ 125°C (TA); Mounting Type: Surface Mount; Package / Case: SC-74A, SOT-753; Supplier Device Package: SOT-23-5; ComponentLink1URL: http://www.ti.com/lit/ds/symlink/sn74ahct1g125.pdf; ComponentLink1Description: http://www.ti.com/lit/ds/symlink/sn74ahct1g125.pdf; Supplier Part Number 1: 296-4708-1-ND
U?#5 = LTC1871EMS#PBF: Wide Input Range, No Rsense Current Mode Boost, Flyback and SEPIC Controller, 10-pin SOP (MS-10), -40 to 85 degC, Pb-Free; Manufacturer: Linear Technology; Number of Outputs: 1; DatasheetVersion: Rev. E; PackageVersion: Rev. E, 06/2010; PackageReference: MS-10; PackageDescription: 10-Pin Plastic MSOP, Body 3 x 3 mm, Pitch 0.5 mm; Supplier 1: Digi-Key; Supplier Part Number 1: LTC1871EMS#PBF-ND; Supplier 2: Farnell; Supplier Part Number 2: 1273534; Supplier 3: Newark; Supplier Part Number 3: 56M4256; RoHS: TRUE; Mounting Technology: Surface Mount; PartNumber: LTC1871EMS#PBF; ComponentLink1Description: Manufacturer URL; ComponentLink1URL: http://www.linear.com/; ComponentLink2Description: Datasheet; ComponentLink2URL: http://cds.linear.com/docs/en/datasheet/1871fe.pdf; ComponentLink3Description: Package Specification; ComponentLink3URL: http://cds.linear.com/docs/en/packaging/05081661_F_MS.pdf
U?#6 = FETDRIVER_LT1910: IC MOSFET DRIVER HI-SIDE 8-SOIC; Manufacturer: Linear Technology; Manufacturer Part Number: LT1910IS8#PBF; Driven Configuration: High-Side; Channel Type: Single; Number of Drivers: 1; Gate Type: N-Channel MOSFET; Voltage - Supply: 8 V ~ 48 V; Logic Voltage - VIL, VIH: 0.7V, 3.5V; Input Type: Non-Inverting; Supplier 1: Digi-Key; RoHS: RoHS Compliant; Category: Integrated Circuits (ICs); Stock 1: 1058; Pricing 1: 1=4.52, 25=3.03, 100=2.57 (USD); Packaging: Tube; Current - Peak Output (Source, Sink): -; High Side Voltage - Max (Bootstrap): -; Rise / Fall Time (Typ): -; Operating Temperature: -40°C ~ 125°C (TJ); Mounting Type: Surface Mount; Package / Case: 8-SOIC (0.154", 3.90mm Width); Supplier Device Package: 8-SOIC; ComponentLink1URL: http://www.linear.com/docs/3996; ComponentLink1Description: http://www.linear.com/docs/3996
U?#7 = TSENSE_TC74: Board Mount Temperature Sensors Digital Thermal; Manufacturer: Microchip Technology; Manufacturer Part Number: TC74A5-3.3VCTTR; Sensor Type: Digital, Local; Sensing Temperature - Local: -40°C ~ 125°C; Output Type: I²C/SMBus; Voltage - Supply: 2.7 V ~ 5.5 V; Resolution: 7 b; Accuracy - Highest (Lowest): ±2°C (±3°C); Test Condition: 25°C ~ 85°C (0°C ~ 125°C); Supplier 1: Digi-Key; RoHS: RoHS Compliant; Category: Sensors, Transducers; Stock 1: 7461; Pricing 1: 1=0.87, 25=0.72, 100=0.66 (USD); Packaging: Cut Tape (CT); Sensing Temperature - Remote: -; Features: Standby Mode; Operating Temperature: -40°C ~ 125°C; Package / Case: SC-74A, SOT-753; Supplier Device Package: SOT-23-5; ComponentLink1URL: http://www.microchip.com/mymicrochip/filehandler.aspx?ddocname=en011621; ComponentLink1Description: http://www.microchip.com/mymicrochip/filehandler.aspx?ddocname=en011621
U?#8 = ISENSE_ACS711: SENSOR CURRENT HALL 12.5A AC/DC; Manufacturer: Allegro MicroSystems, LLC; Manufacturer Part Number: ACS711KLCTR-12AB-T; Sensor Type: Hall Effect, Open Loop; Number of Channels: 1; Output: Ratiometric, Voltage; Sensitivity: 110mV/A; Frequency: DC ~ 100kHz; Linearity: ±1%; Accuracy: ±5%; Voltage - Supply: 3 V ~ 5.5 V; Response Time: 4.6µs; Current - Supply (Max): 5.5mA; Polarization: Bidirectional; Supplier 1: Digi-Key; RoHS: RoHS Compliant; Category: Sensors, Transducers; Stock 1: 2289; Pricing 1: 1=3.39, 5=3.146, 10=2.614, 25=2.178, 50=1.936, 100=1.8392, 500=1.5488, 1000=1.452 (USD); Packaging: Cut Tape (CT); For Measuring: AC/DC; Current - Sensing: 12.5A; Operating Temperature: -40°C ~ 125°C; Mounting Type: Surface Mount; Package / Case: 8-SOIC (0.154", 3.90mm Width); ComponentLink1URL: http://www.allegromicro.com/en/Products/Part_Numbers/0711/0711.pdf; ComponentLink1Description: http://www.allegromicro.com/en/Products/Part_Numbers/0711/0711.pdf
U?#9 = SEEEDSTUDIO_nRF24L01+: RF24L01 ULP 2Mbps RF transceiver 2.4GHz ISM
Z? = __template_diode_zener: Manufacturer: ON Semiconductor; Manufacturer Part Number: P6SMB6.8AT3G; Unidirectional Channels: 1; Voltage - Reverse Standoff (Typ): 5.8V; Voltage - Breakdown (Min): 6.45V; Voltage - Clamping (Max) @ Ipp: 10.5V; Current - Peak Pulse (10/1000µs): 57A; Power - Peak Pulse: 600W; Power Line Protection: No; Capacitance @ Frequency: 2380pF @ 1MHz; Supplier 1: Digi-Key; Supplier Part Number 1: P6SMB6.8AT3GOSTR-ND; RoHS: RoHS Compliant; Category: Circuit Protection; Stock 1: 12500; Pricing 1: 2500=0.11006, 5000=0.10339, 12500=0.09672, 25000=0.08871, 62500=0.08538, 125000=0.08204 (USD); Packaging: Tape & Reel (TR); Type: Zener; Bidirectional Channels: -; Applications: Automotive; Operating Temperature: -65°C ~ 150°C (TJ); Mounting Type: Surface Mount; Package / Case: DO-214AA, SMB; Supplier Device Package: SMB; ComponentLink1URL: http://www.onsemi.com/pub_link/Collateral/P6SMB6.8AT3-D.PDF; ComponentLink1Description: http://www.onsemi.com/pub_link/Collateral/P6SMB6.8AT3-D.PDF